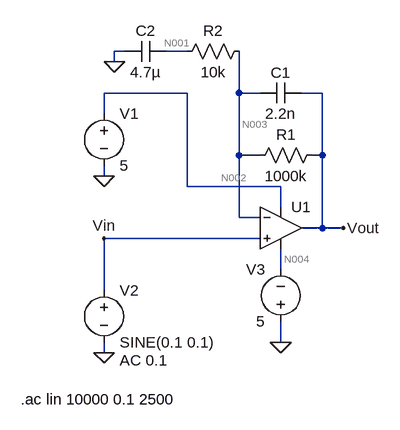
[diagram p0: schematic Draft2.asc]
Draft2.asc, the LTspice schematic file:
Version 4
SHEET 1 880 680
WIRE -32 -96 -48 -96
WIRE 64 -96 32 -96
WIRE -48 -80 -48 -96
WIRE 64 -32 -64 -32
WIRE 144 -32 144 -96
WIRE 176 -32 144 -32
WIRE 272 -32 240 -32
WIRE -64 0 -64 -32
WIRE 144 64 144 -32
WIRE 176 64 144 64
WIRE 272 64 272 -32
WIRE 272 64 256 64
WIRE -64 96 -64 80
WIRE 64 112 64 -32
WIRE 208 112 64 112
WIRE 208 144 208 112
WIRE 144 160 144 64
WIRE 176 160 144 160
WIRE 272 176 272 64
WIRE 272 176 240 176
WIRE 304 176 272 176
WIRE 176 192 -64 192
WIRE 208 240 208 208
WIRE -64 272 -64 192
WIRE 208 352 208 320
WIRE -64 368 -64 352
FLAG -64 96 0
FLAG -64 368 0
FLAG -64 192 Vin
FLAG 304 176 Vout
FLAG 208 352 0
FLAG -48 -80 0
SYMBOL OpAmps\\UniversalOpamp2 208 176 R0
SYMATTR InstName U1
SYMBOL voltage -64 -16 R0
WINDOW 123 0 0 Left 0
WINDOW 39 0 0 Left 0
SYMATTR InstName V1
SYMATTR Value 5
SYMBOL voltage -64 256 R0
WINDOW 123 24 124 Left 2
WINDOW 39 0 0 Left 0
SYMATTR InstName V2
SYMATTR Value SINE(0.1 0.1)
SYMATTR Value2 AC 0.1
SYMBOL res 272 48 R90
WINDOW 0 0 56 VBottom 2
WINDOW 3 32 56 VTop 2
SYMATTR InstName R1
SYMATTR Value 1000k
SYMBOL cap 240 -48 R90
WINDOW 0 0 32 VBottom 2
WINDOW 3 32 32 VTop 2
SYMATTR InstName C1
SYMATTR Value 2.2n
SYMBOL voltage 208 336 R180
WINDOW 0 24 96 Left 2
WINDOW 3 24 16 Left 2
WINDOW 123 0 0 Left 0
WINDOW 39 0 0 Left 0
SYMATTR InstName V3
SYMATTR Value 5
SYMBOL res 160 -112 R90
WINDOW 0 0 56 VBottom 2
WINDOW 3 32 56 VTop 2
SYMATTR InstName R2
SYMATTR Value 10k
SYMBOL cap 32 -112 R90
WINDOW 0 0 32 VBottom 2
WINDOW 3 32 32 VTop 2
SYMATTR InstName C2
SYMATTR Value 4.7µ
TEXT -192 440 Left 2 !.ac lin 10000 0.1 2500

The netlist it stands for:
* Draft2.asc
XU1 Vin N003 N002 N004 Vout level.2 Avol=1Meg GBW=10Meg Slew=10Meg ilimit=25m rail=0 Vos=0 phimargin=45 en=0 enk=0 in=0 ink=0 Rin=500Meg  ; pins IN+ IN- V+ V- OUT
V1 N002 0 5
V2 Vin 0 SINE(0.1 0.1) AC 0.1
R1 Vout N003 1000k
C1 Vout N003 2.2n
V3 0 N004 5
R2 N003 N001 10k
C2 N001 0 4.7µ
.ac lin 10000 0.1 2500
.lib UniversalOpamps2.sub
.backanno
.end

* Results of the author's LTspice run, read from the files saved beside the schematic
* Operating Point, zero values left out:
*   V(vout) = 100.2 mV
*   V(n002) = 5 V
*   V(n004) = -5 V
*   V(n003) = 100 mV
*   V(vin) = 100 mV
*   V(n001) = 100 mV
*   I(R1) = 200 pA
*   I(V3) = -499.9 µA
*   I(V2) = -200 pA
*   I(V1) = -499.9 µA
*   Ix(u1:1) = 200 pA
*   Ix(u1:2) = 200 pA
*   Ix(u1:3) = 499.9 µA
*   Ix(u1:4) = -499.9 µA
*   Ix(u1:5) = -200 pA
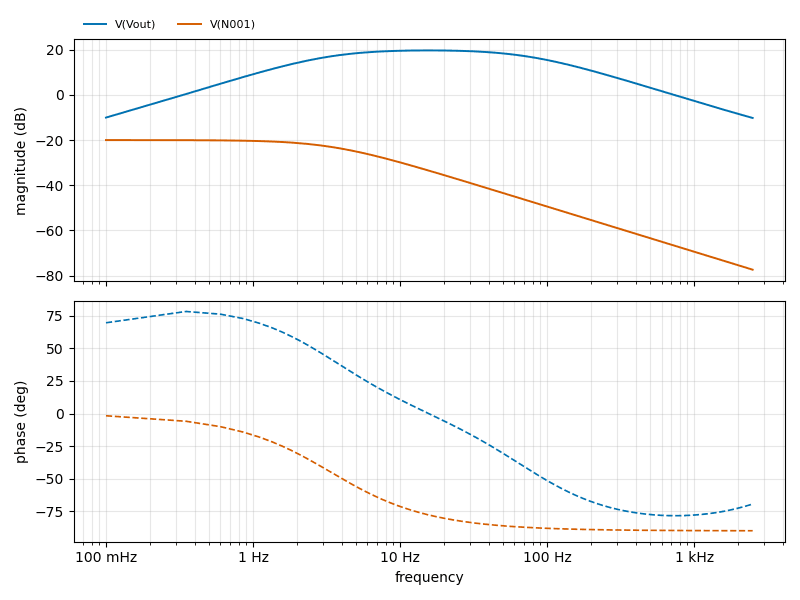
[diagram p1: AC Analysis of Draft2.asc, plotted from the saved traces]
* AC Analysis, 1 run:
*   V(Vout): -10.04 dB at 100 mHz, -10.21 dB at 2.5 kHz, peak 19.69 dB at 15.6 Hz, 3 dB below the peak at 3.107 Hz and 78.8 Hz
*   V(N001): -20.00 dB at 100 mHz, -77.37 dB at 2.5 kHz, peak -20.00 dB at 100 mHz, 3 dB below the peak at 3.388 Hz